# EasyEDA Pro project RM_超级电容控制板.eprj, schematic Sheet_1
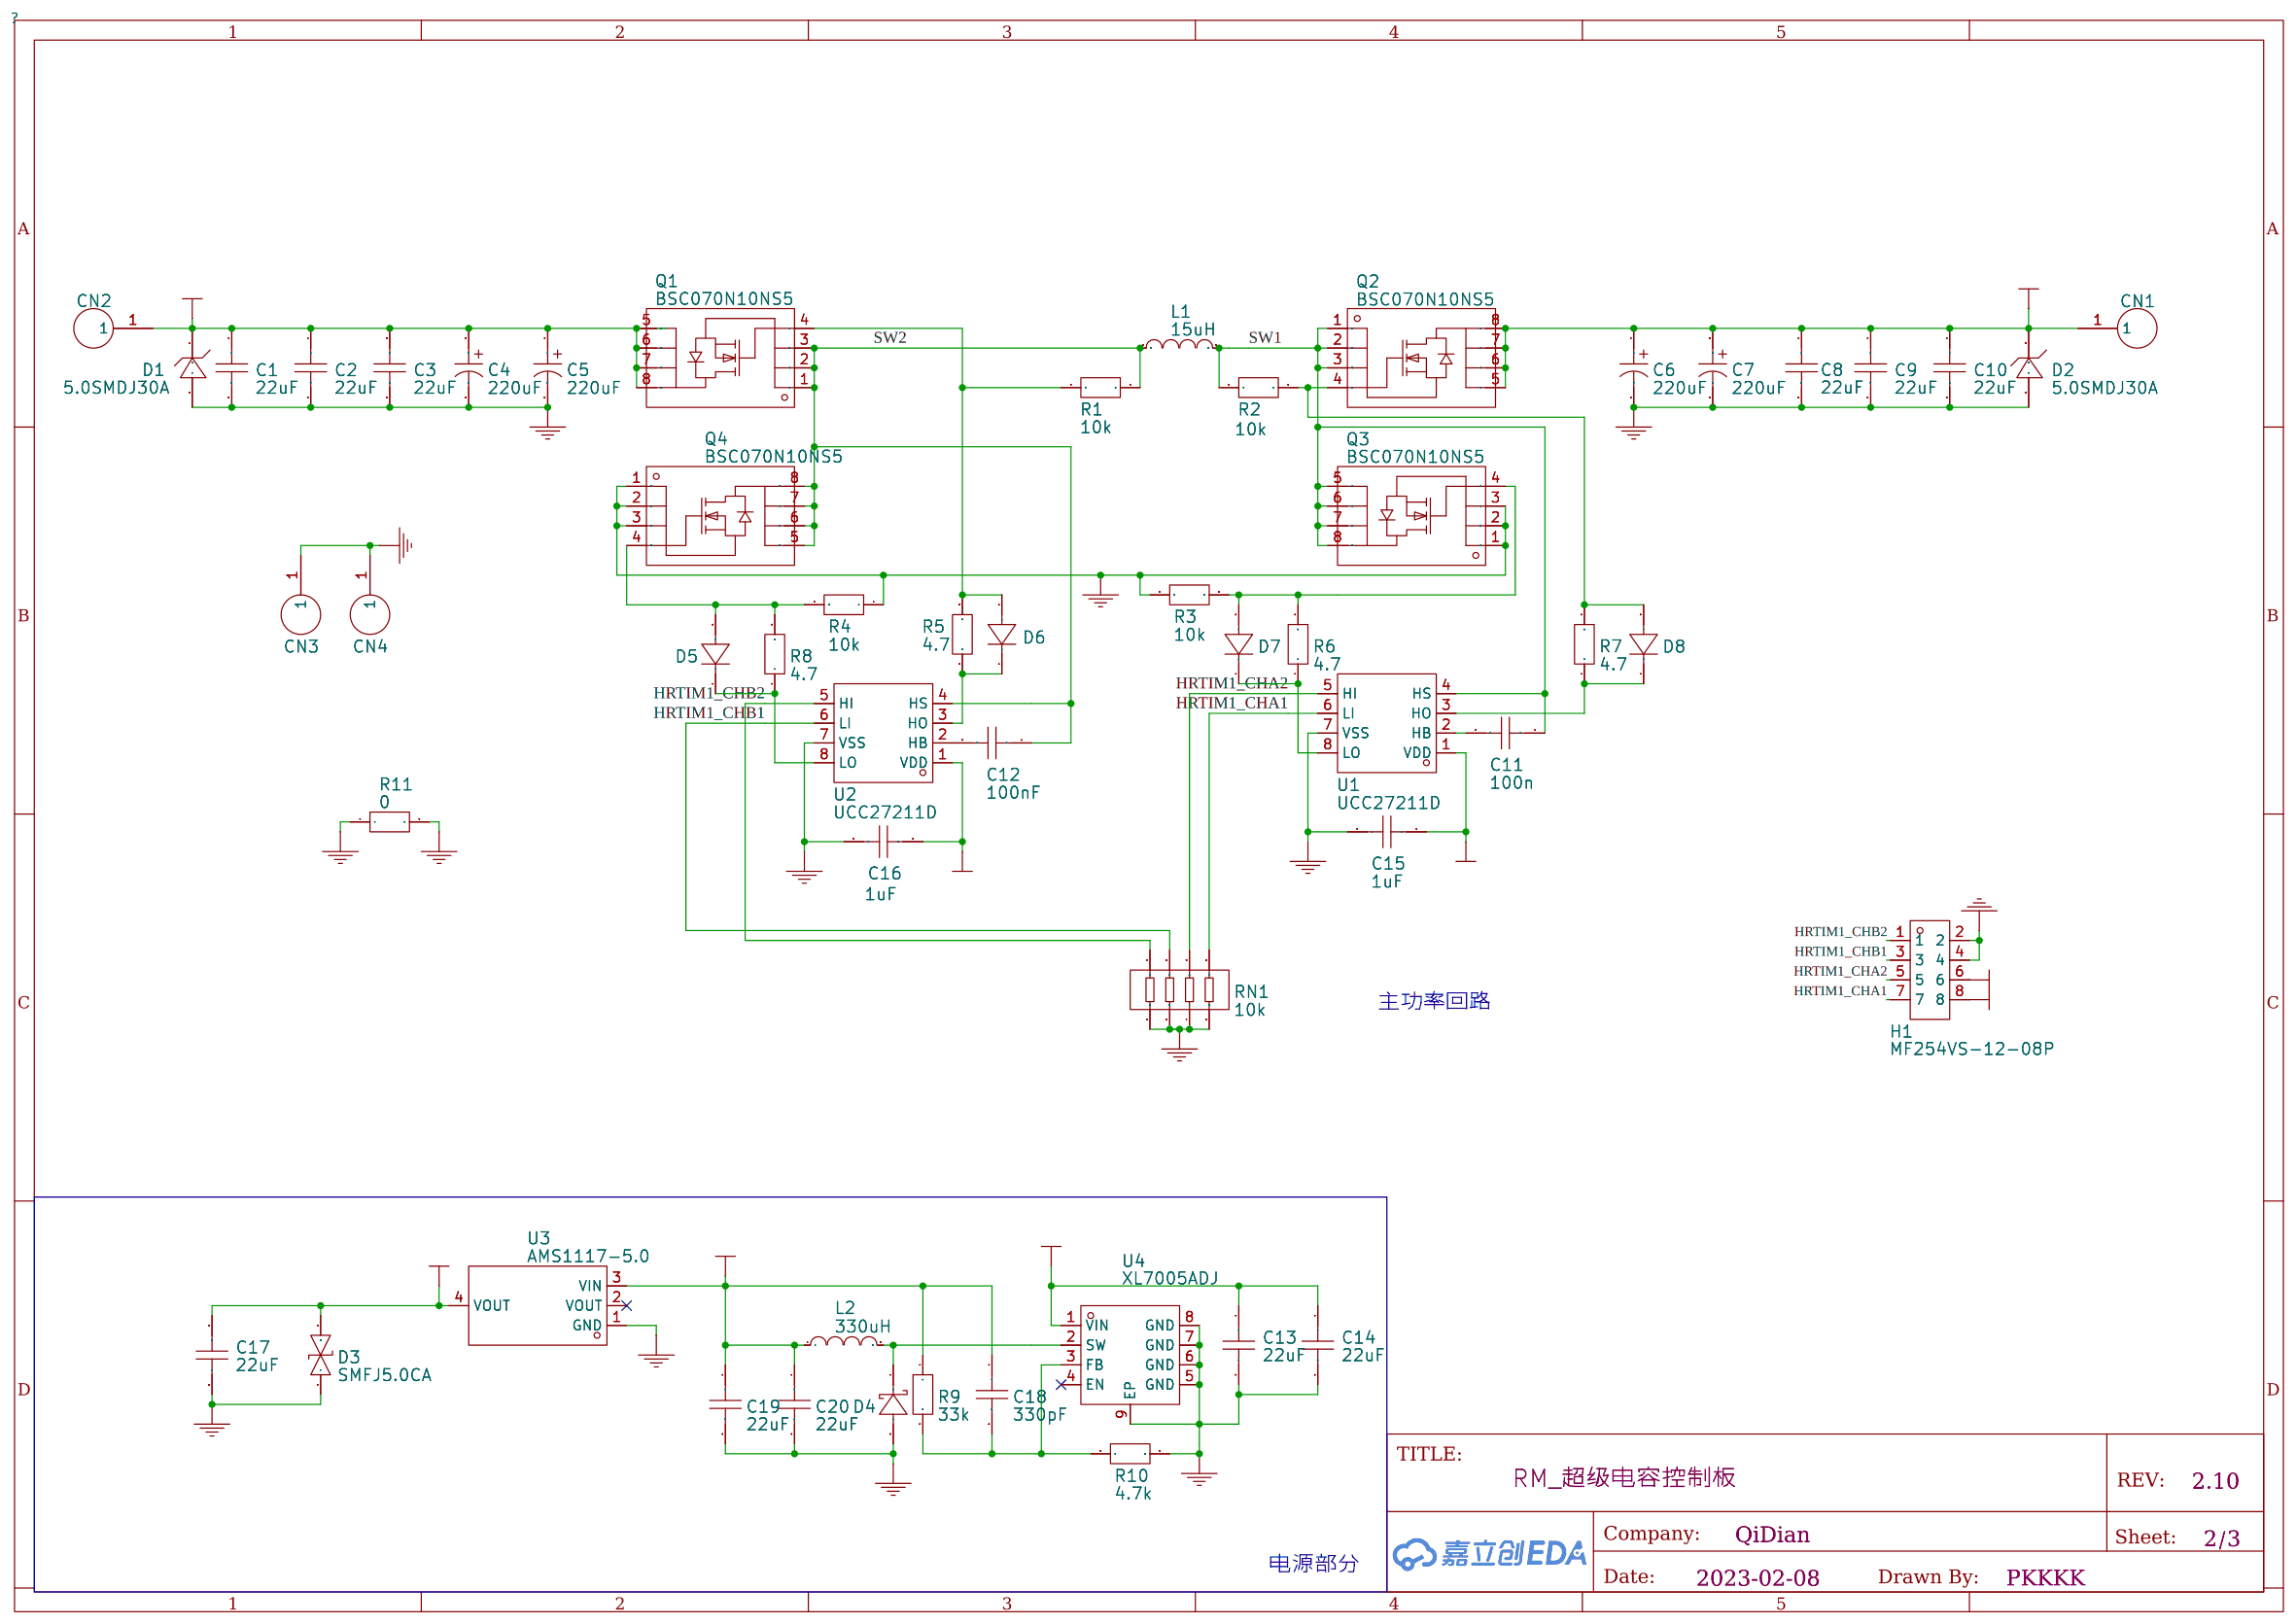
[diagram p2: schematic sheet]

## Parts
C1  22uF  [C0805]
C2  22uF  [C0805]
C3  22uF  [C0805]
C4  220uF  [CAP-SMD_BD8.0-L8.3-W8.3-LS9.3-FD]
C5  220uF  [CAP-SMD_BD8.0-L8.3-W8.3-LS9.3-FD]
C6  220uF  [CAP-SMD_BD8.0-L8.3-W8.3-LS9.3-FD]
C7  220uF  [CAP-SMD_BD8.0-L8.3-W8.3-LS9.3-FD]
C8  22uF  [C0805]
C9  22uF  [C0805]
C10  22uF  [C0805]
C11  100n  [C0603]
C12  100nF  [C0603]
C13  22uF  [C0805]
C14  22uF  [C0805]
C15  1uF  [C0603]
C16  1uF  [C0603]
C17  22uF  [C0805]
C18  330pF  [C0603]
C19  22uF  [C0805]
C20  22uF  [C0805]
CN1  m3铜柱  [SMT铜柱]
CN2  m3铜柱  [SMT铜柱]
CN3  m3铜柱  [SMT铜柱]
CN4  m3铜柱  [SMT铜柱]
D1  5.0SMDJ30A  [SMC_L6.9-W5.9-LS7.9-RD]
D2  5.0SMDJ30A  [SMC_L6.9-W5.9-LS7.9-RD]
D3  SMFJ5.0CA  [SOD-123FL_L2.8-W1.8-LS3.7-BI]
D4  DSK310_C713648  [SOD-123_L2.7-W1.8-LS3.7-RD]
D5  1N4007WS  [SOD-323_L1.6-W1.3-LS2.6-RD]
D6  1N4007WS  [SOD-323_L1.6-W1.3-LS2.6-RD]
D7  1N4007WS  [SOD-323_L1.6-W1.3-LS2.6-RD]
D8  1N4007WS  [SOD-323_L1.6-W1.3-LS2.6-RD]
H1  MF254VS-12-08P  [HDR-SMD_8P-P2.54_MF254VS-12-08P]
L1  15uH  [IND-SMD_L17.5-W17.0_YXMAC1770]
L2  330uH  [IND-SMD_L6.0-W6.0_SWPA6045S]
Q1  BSC070N10NS5  [PG-TDSON-8_L5.0-W6.0-P1.27-BL-EP]
Q2  BSC070N10NS5  [PG-TDSON-8_L5.0-W6.0-P1.27-BL-EP]
Q3  BSC070N10NS5  [PG-TDSON-8_L5.0-W6.0-P1.27-BL-EP]
Q4  BSC070N10NS5  [PG-TDSON-8_L5.0-W6.0-P1.27-BL-EP]
R1  10k  [R0603]
R2  10k  [R0603]
R3  10k  [R0603]
R4  10k  [R0603]
R5  4.7  [R0603]
R6  4.7  [R0603]
R7  4.7  [R0603]
R8  4.7  [R0603]
R9  33k  [R0603]
R10  4.7k  [R0603]
R11  0  [R1206]
RN1  10k  [RES-ARRAY-SMD_0603-8P-L3.2-W1.6-BL]
U1  UCC27211D  [SOIC-8_L4.9-W3.9-P1.27-LS6.2-BL]
U2  UCC27211D  [SOIC-8_L4.9-W3.9-P1.27-LS6.2-BL]
U3  AMS1117-5.0  [SOT-223_L6.5-W3.5-P2.30-LS7.0-BR]
U4  XL7005ADJ  [ESOP-8_L4.9-W3.9-P1.27-LS6.0-BL-EP]

## Library data of the parts
C1-C3 C8-C10 C13 C14 C17 C19 C20 = 22u: link: https://item.szlcsc.com/373011.html; 3DModel: C0805_L2.0-W1.3-H1.3
C4-C7 = 220uF: link: https://cn.bing.com/search?q=datasheet: UBC1V470MNS1GS; Supplier: LCSC; Supplier Part: C2836441; Manufacturer: KNSCHA(科尼盛); Manufacturer Part: RVT220UF35V67RV0024; JLCPCB Part Class: Extended Part
C11 C12 = 100n: link: https://item.szlcsc.com/362304.html; 3DModel: C0603_L1.6-W0.8-H0.8
C15 C16 = 1u: link: https://item.szlcsc.com/362304.html; 3DModel: C0603_L1.6-W0.8-H0.8
C18 = 330pF: link: https://item.szlcsc.com/362304.html; 3DModel: C0603_L1.6-W0.8-H0.8
CN1-CN4 = m3铜柱: 3DModel: SMD_BD5.6-L5.6-W5.6-D4.1
D1 D2 = 5.0SMDJ30A: link: https://item.szlcsc.com/279381.html; Supplier: LCSC; Supplier Part: C152052; Manufacturer: BORN(伯恩半导体); JLCPCB Part Class: Extended Part
D3 = SMFJ5.0CA: link: https://item.szlcsc.com/125068.html; 3DModel: SOD-123FL_L2.8-W1.8-H1.1-LS3.6; Supplier: LCSC; Supplier Part: C152064; Manufacturer: BORN伯恩半导体; JLCPCB Part Class: Extended Part
D4 = DSK310_C713648: link: https://atta.szlcsc.com/upload/public/pdf/source/20191009/C435458_48A497743F79394405122F4857DC52B9.pdf; Supplier: LCSC; Supplier Part: C713648; Manufacturer: LGE(鲁光); Manufacturer Part: DSK310; JLCPCB Part Class: Extended Part
D5-D8 = 1N4007WS: link: https://atta.szlcsc.com/upload/public/pdf/source/20220711/4C2972FB12D9032147C5F0E550758DFB.pdf; Supplier: LCSC; Supplier Part: C4355046; Manufacturer: FUXINSEMI(富芯森美)
H1 = MF254VS-12-08P: link: https://atta.szlcsc.com/upload/public/pdf/source/20200309/C492239_F734562B831B61170897713D3A373CC7.pdf; Supplier: LCSC; Supplier Part: C492239; Manufacturer: XFCN(兴飞); JLCPCB Part Class: Extended Part
L1 = 15uH: link: https://item.szlcsc.com/240283.html; 3DModel: IND-SMD_L17.5-W17.2-H7.0_YXMAC1770; Supplier: LCSC; Supplier Part: C357279; Manufacturer: TAITEC; Manufacturer Part: TMPC1707HP-150MG-D; JLCPCB Part Class: Extended Part
L2 = 330uH: link: https://item.szlcsc.com/72664.html; 3DModel: IND-SMD_L6.0-W6.0-H4.5; Supplier: LCSC; Manufacturer: Sunlord; Manufacturer Part: SWPA6045S331MT; Supplier Part: C83453; JLCPCB Part Class: Extended Part
Q1-Q4 = BSC070N10NS5: link: https://item.szlcsc.com/558227.html; 3DModel: PG-TDSON-8_L5.0-W6.0-H0.9-P1.27-BL-EP; Supplier: LCSC; Supplier Part: C534414; Manufacturer: Infineon(英飞凌); Manufacturer Part: BSC123N10LS G; JLCPCB Part Class: Extended Part
R1-R4 = 10k: link: https://www.mouser.in/datasheet/2/447/PYu_RT_1_to_0_01_RoHS_L_11-1669912.pdf
R5-R8 = 4.7: link: https://www.mouser.in/datasheet/2/447/PYu_RT_1_to_0_01_RoHS_L_11-1669912.pdf
R9 = 33k: link: https://www.mouser.in/datasheet/2/447/PYu_RT_1_to_0_01_RoHS_L_11-1669912.pdf
R10 = 4.7k: link: https://www.mouser.in/datasheet/2/447/PYu_RT_1_to_0_01_RoHS_L_11-1669912.pdf
R11 = 0: link: https://item.szlcsc.com/311874.html; 3DModel: R1206_L3.2-W1.6-H0.6; Supplier: LCSC; Supplier Part: C3018073; Manufacturer: VO(翔胜); Manufacturer Part: SCR1206J1M; JLCPCB Part Class: Extended Part
RN1 = 10k: link: https://item.szlcsc.com/20907.html; 3DModel: R0603-8P_L3.2-W1.6-H0.6; Supplier: LCSC; Supplier Part: C425226; Manufacturer: UNI-ROYAL(厚声); Manufacturer Part: 4D03WGF2400T5E; Resistance: 240; JLCPCB Part Class: Extended Part
U1 U2 = UCC27211D: Supplier: LCSC; Supplier Part: C1549388; Manufacturer: TI(德州仪器)
U3 = AMS1117-5.0: link: https://item.szlcsc.com/109711.html; 3DModel: SOT-223-4P_L6.5-W3.5-H1.6-LS7.0-P2.30; Supplier: LCSC; Manufacturer: AMS; Supplier Part: C6187; JLCPCB Part Class: Basic Part
U4 = XL7005ADJ: link: https://www.mornsun.cn/html/pdf/SCM1501B.html; 3DModel: ESOP-8_L4.9-W3.9-H1.6-LS6.0-P1.27; Supplier: LCSC; Supplier Part: C9900008382; Manufacturer: XLSEMI; JLCPCB Part Class: Extended Part

## Nets
10V: C15.1 C16.1 C18.1 C19.1 C20.1 L2.1 R9.1 U1.1(VDD) U2.1(VDD) U3.3(VIN)
+5V: C17.1 D3.2 H1.6 U3.4(VOUT)
GND: C1.2 C2.2 C3.2 C4.2 C5.2 C6.2 C7.2 C8.2 C9.2 C10.2 C13.2 C14.2 C15.2 C16.2 C17.2 C19.2 C20.2 CN3.1 CN4.1 D1.2(A) D2.2(A) D3.1 D4.2(A) H1.2 H1.4 Q3.1(S) Q3.2(S) Q3.3(S) Q4.1(S) Q4.2(S) Q4.3(S) R3.2 R4.1 R10.2 R11.1 R11.2 RN1.5 RN1.6 RN1.7 RN1.8 U1.7(VSS) U2.7(VSS) U3.1(GND) U4.5(GND) U4.6(GND) U4.7(GND) U4.8(GND) U4.9(EP)
VCC: C6.1 C7.1 C8.1 C9.1 C10.1 CN1.1 D2.1(C) Q2.5(D) Q2.6(D) Q2.7(D) Q2.8(D)
VCC1: C13.1 C14.1 H1.8 U4.1(VIN)
HRTIM1_CHA1: H1.7 RN1.1 U1.6(LI)
HRTIM1_CHA2: H1.5 RN1.2 U1.5(HI)
HRTIM1_CHB1: H1.3 RN1.3 U2.6(LI)
HRTIM1_CHB2: H1.1 RN1.4 U2.5(HI)
SW1: C11.1 L1.2 Q2.1(S) Q2.2(S) Q2.3(S) Q3.5(D) Q3.6(D) Q3.7(D) Q3.8(D) R2.2 U1.4(HS)
SW2: C12.1 L1.1 Q1.1(S) Q1.2(S) Q1.3(S) Q4.5(D) Q4.6(D) Q4.7(D) Q4.8(D) R1.2 U2.4(HS)
VCUP: C1.1 C2.1 C3.1 C4.1 C5.1 CN2.1 D1.1(C) Q1.5(D) Q1.6(D) Q1.7(D) Q1.8(D)
$1N34: D5.2(A) Q4.4(G) R4.2 R8.2
$1N35: D6.2(A) Q1.4(G) R1.1 R5.2
$1N36: D8.2(A) Q2.4(G) R2.1 R7.2
$1N40: D7.2(A) Q3.4(G) R3.1 R6.2
$1N92: C11.2 U1.2(HB)
$1N105: D5.1(K) R8.1 U2.8(LO)
$1N120: D6.1(K) R5.1 U2.3(HO)
$1N161: D8.1(K) R7.1 U1.3(HO)
$1N172: D7.1(K) R6.1 U1.8(LO)
$1N280: C18.2 R9.2 R10.1 U4.3(FB)
$1N391: D4.1(K) L2.2 U4.2(SW)
$1N753: C12.2 U2.2(HB)

Not connected (* = marked no-connect by the designer): U3 2(VOUT)*; U4 4(EN)*

## Notes on the sheet
- 主功率回路
- 电源部分
